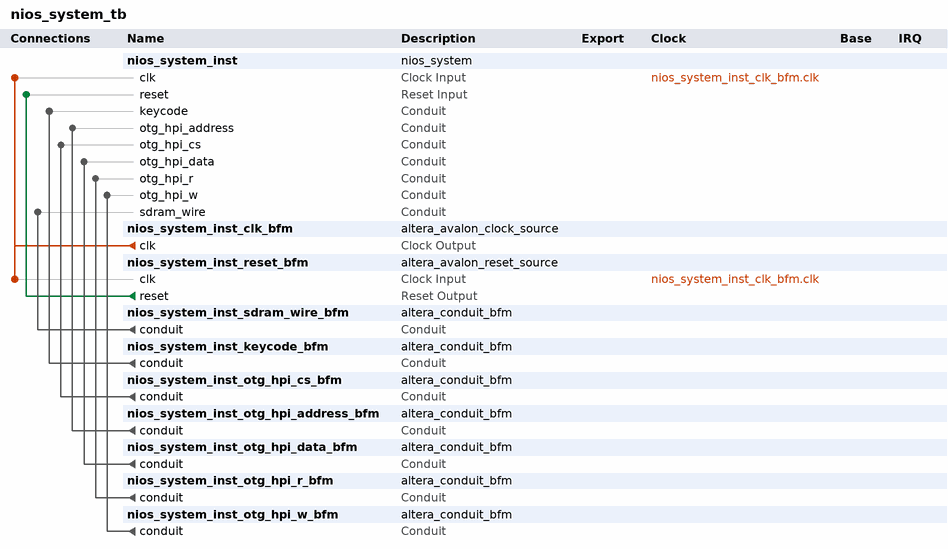
[diagram p0: system contents]
# Platform Designer (Qsys) system nios_system_tb, Cyclone IV E EP4CE115F29C7
# Parameters at their usual value, and those the tool derives, are not listed.
package require -exact qsys 14.0
create_system nios_system_tb
set_project_property DEVICE_FAMILY {Cyclone IV E}
set_project_property DEVICE EP4CE115F29C7

add_instance nios_system_inst nios_system 1.0

add_instance nios_system_inst_clk_bfm altera_avalon_clock_source 14.0

add_instance nios_system_inst_reset_bfm altera_avalon_reset_source 14.0
set_instance_parameter_value nios_system_inst_reset_bfm ASSERT_HIGH_RESET 0
set_instance_parameter_value nios_system_inst_reset_bfm INITIAL_RESET_CYCLES 50

add_instance nios_system_inst_sdram_wire_bfm altera_conduit_bfm 14.0
set_instance_parameter_value nios_system_inst_sdram_wire_bfm CLOCKED_SIGNAL false
set_instance_parameter_value nios_system_inst_sdram_wire_bfm ENABLE_RESET false
set_instance_parameter_value nios_system_inst_sdram_wire_bfm SIGNAL_ROLES addr,ba,cas_n,cke,cs_n,dq,dqm,ras_n,we_n
set_instance_parameter_value nios_system_inst_sdram_wire_bfm SIGNAL_WIDTHS 13,2,1,1,1,32,4,1,1
set_instance_parameter_value nios_system_inst_sdram_wire_bfm SIGNAL_DIRECTIONS input,input,input,input,input,bidir,input,input,input

add_instance nios_system_inst_keycode_bfm altera_conduit_bfm 14.0
set_instance_parameter_value nios_system_inst_keycode_bfm CLOCKED_SIGNAL false
set_instance_parameter_value nios_system_inst_keycode_bfm ENABLE_RESET false
set_instance_parameter_value nios_system_inst_keycode_bfm SIGNAL_WIDTHS 16
set_instance_parameter_value nios_system_inst_keycode_bfm SIGNAL_DIRECTIONS input

add_instance nios_system_inst_otg_hpi_cs_bfm altera_conduit_bfm 14.0
set_instance_parameter_value nios_system_inst_otg_hpi_cs_bfm CLOCKED_SIGNAL false
set_instance_parameter_value nios_system_inst_otg_hpi_cs_bfm ENABLE_RESET false
set_instance_parameter_value nios_system_inst_otg_hpi_cs_bfm SIGNAL_WIDTHS 1
set_instance_parameter_value nios_system_inst_otg_hpi_cs_bfm SIGNAL_DIRECTIONS input

add_instance nios_system_inst_otg_hpi_address_bfm altera_conduit_bfm 14.0
set_instance_parameter_value nios_system_inst_otg_hpi_address_bfm CLOCKED_SIGNAL false
set_instance_parameter_value nios_system_inst_otg_hpi_address_bfm ENABLE_RESET false
set_instance_parameter_value nios_system_inst_otg_hpi_address_bfm SIGNAL_WIDTHS 2
set_instance_parameter_value nios_system_inst_otg_hpi_address_bfm SIGNAL_DIRECTIONS input

add_instance nios_system_inst_otg_hpi_data_bfm altera_conduit_bfm 14.0
set_instance_parameter_value nios_system_inst_otg_hpi_data_bfm CLOCKED_SIGNAL false
set_instance_parameter_value nios_system_inst_otg_hpi_data_bfm ENABLE_RESET false
set_instance_parameter_value nios_system_inst_otg_hpi_data_bfm SIGNAL_ROLES in_port,out_port
set_instance_parameter_value nios_system_inst_otg_hpi_data_bfm SIGNAL_WIDTHS 16,16
set_instance_parameter_value nios_system_inst_otg_hpi_data_bfm SIGNAL_DIRECTIONS output,input

add_instance nios_system_inst_otg_hpi_r_bfm altera_conduit_bfm 14.0
set_instance_parameter_value nios_system_inst_otg_hpi_r_bfm CLOCKED_SIGNAL false
set_instance_parameter_value nios_system_inst_otg_hpi_r_bfm ENABLE_RESET false
set_instance_parameter_value nios_system_inst_otg_hpi_r_bfm SIGNAL_WIDTHS 1
set_instance_parameter_value nios_system_inst_otg_hpi_r_bfm SIGNAL_DIRECTIONS input

add_instance nios_system_inst_otg_hpi_w_bfm altera_conduit_bfm 14.0
set_instance_parameter_value nios_system_inst_otg_hpi_w_bfm CLOCKED_SIGNAL false
set_instance_parameter_value nios_system_inst_otg_hpi_w_bfm ENABLE_RESET false
set_instance_parameter_value nios_system_inst_otg_hpi_w_bfm SIGNAL_WIDTHS 1
set_instance_parameter_value nios_system_inst_otg_hpi_w_bfm SIGNAL_DIRECTIONS input

# connections
add_connection nios_system_inst_clk_bfm.clk nios_system_inst.clk clock
add_connection nios_system_inst_clk_bfm.clk nios_system_inst_reset_bfm.clk clock
add_connection nios_system_inst_reset_bfm.reset nios_system_inst.reset reset
add_connection nios_system_inst_keycode_bfm.conduit nios_system_inst.keycode conduit
add_connection nios_system_inst_otg_hpi_address_bfm.conduit nios_system_inst.otg_hpi_address conduit
add_connection nios_system_inst_otg_hpi_cs_bfm.conduit nios_system_inst.otg_hpi_cs conduit
add_connection nios_system_inst_otg_hpi_data_bfm.conduit nios_system_inst.otg_hpi_data conduit
add_connection nios_system_inst_otg_hpi_r_bfm.conduit nios_system_inst.otg_hpi_r conduit
add_connection nios_system_inst_otg_hpi_w_bfm.conduit nios_system_inst.otg_hpi_w conduit
add_connection nios_system_inst_sdram_wire_bfm.conduit nios_system_inst.sdram_wire conduit

set_interconnect_requirement {$system} qsys_mm.clockCrossingAdapter HANDSHAKE
set_interconnect_requirement {$system} qsys_mm.maxAdditionalLatency 1
set_interconnect_requirement {$system} qsys_mm.insertDefaultSlave FALSE

save_system nios_system_tb.qsys
